# Altium schematic sheet S09_Connectors.SchDoc: Connectors
size 381 x 241 mm; SheetNumber: 9; SheetTotal: 12
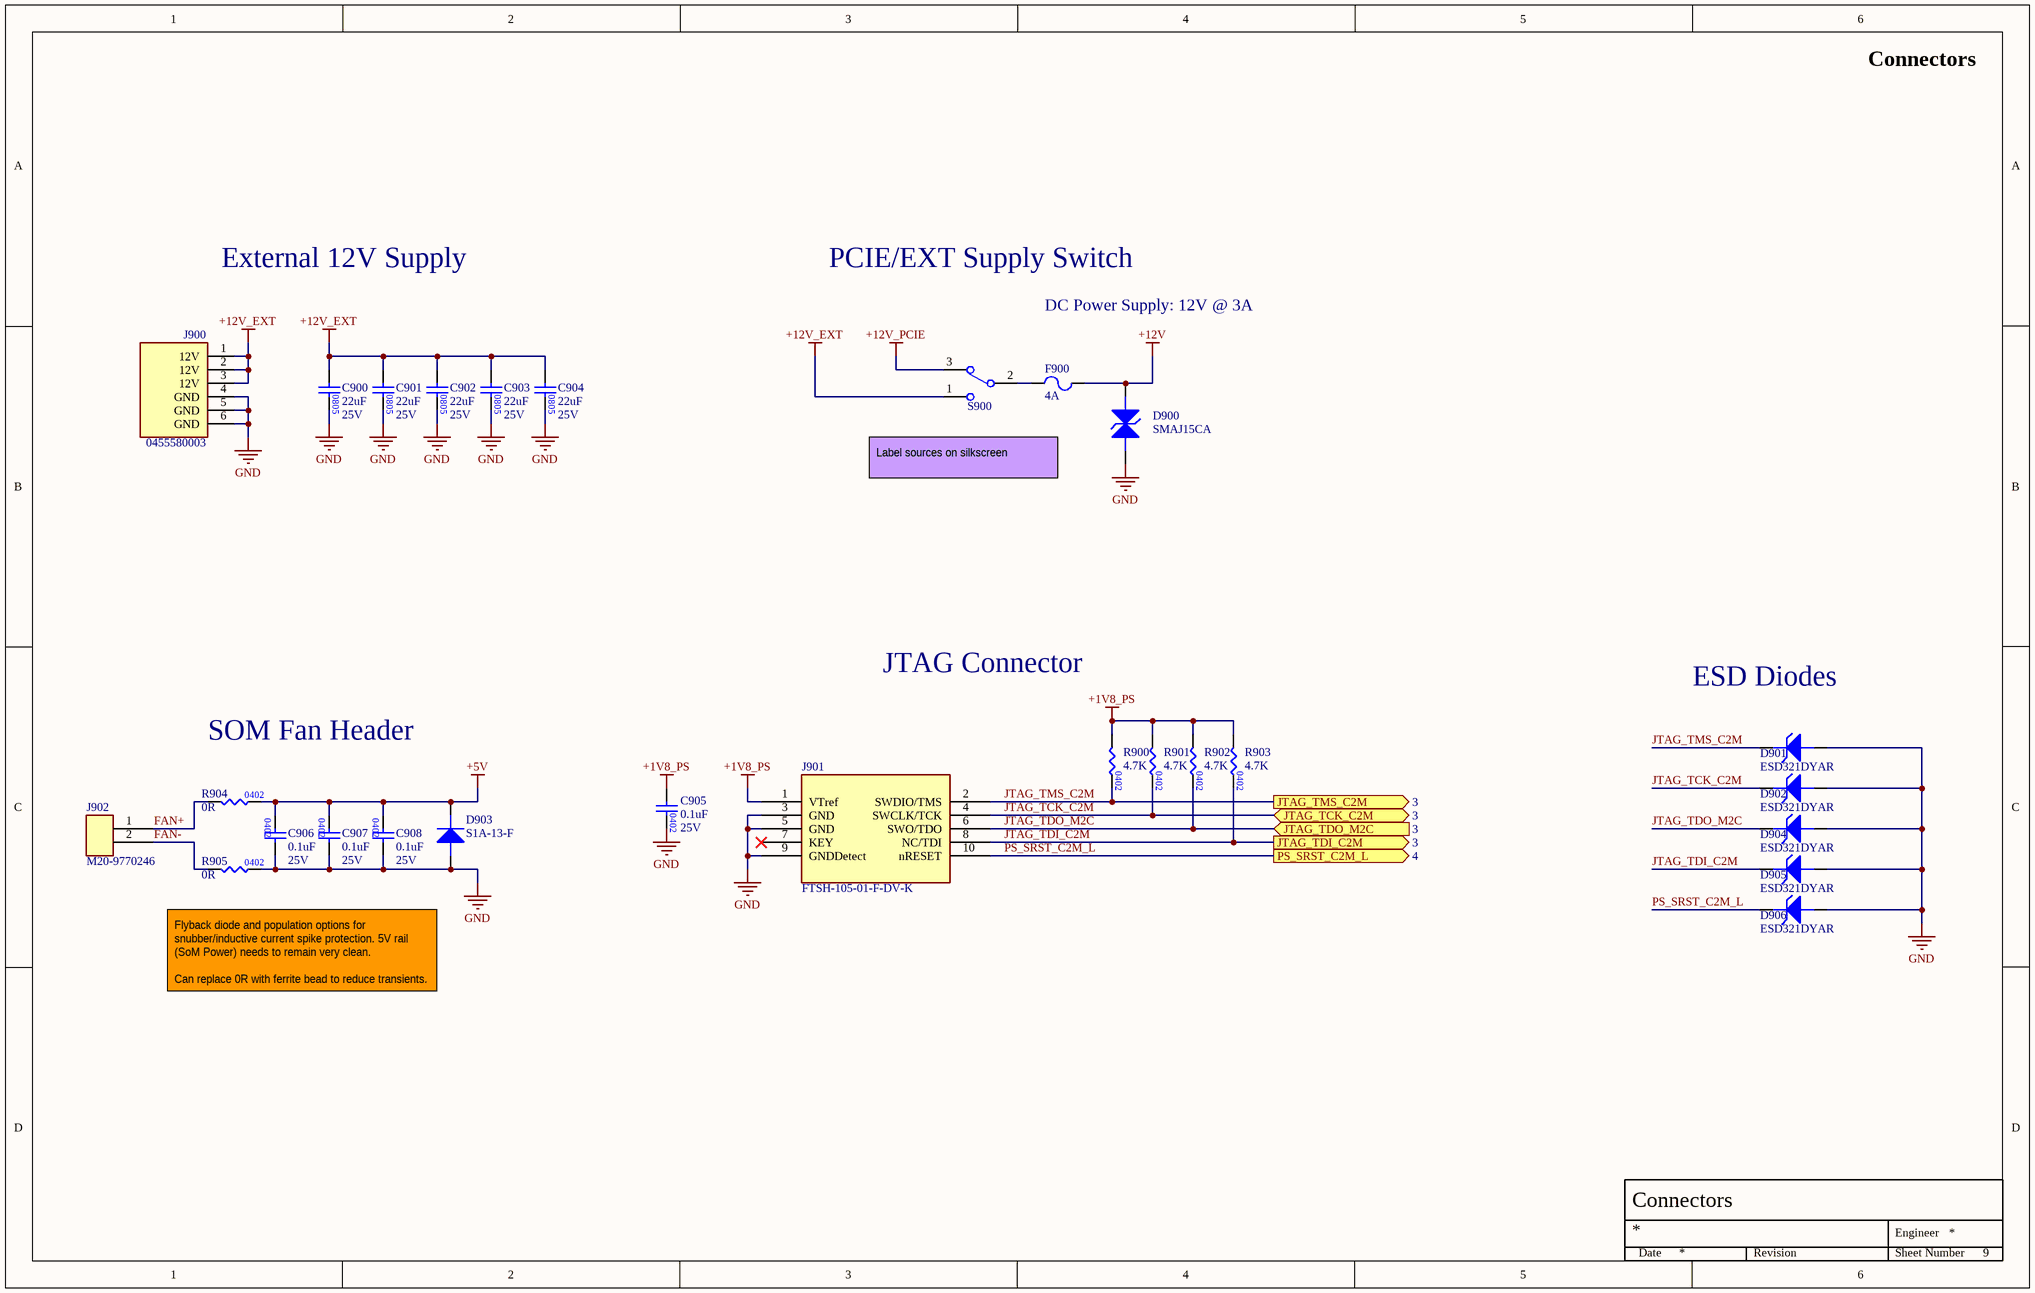
[diagram p0: S09_Connectors.SchDoc]

## Parts
C900  value 22uF  Voltage Rating: 25V  [CAP0805]  (hidden comment: CAP_0805)
C901  value 22uF  Voltage Rating: 25V  [CAP0805]  (hidden comment: CAP_0805)
C902  value 22uF  Voltage Rating: 25V  [CAP0805]  (hidden comment: CAP_0805)
C903  value 22uF  Voltage Rating: 25V  [CAP0805]  (hidden comment: CAP_0805)
C904  value 22uF  Voltage Rating: 25V  [CAP0805]  (hidden comment: CAP_0805)
C905  value 0.1uF  Voltage Rating: 25V  [CAP0402]  (hidden comment: CAP_0402)
C906  value 0.1uF  Voltage Rating: 25V  [CAP0402]  (hidden comment: CAP_0402)
C907  value 0.1uF  Voltage Rating: 25V  [CAP0402]  (hidden comment: CAP_0402)
C908  value 0.1uF  Voltage Rating: 25V  [CAP0402]  (hidden comment: CAP_0402)
D900  TVS DIODE 15VWM 24.4VC DO214AC  [LITTLEFUSE_DO-2014]  (value not drawn)
D901  ESD321DYAR  [TI_SOD523]
D902  ESD321DYAR  [TI_SOD523]
D903  S1A-13-F  [DIODES_SMA]
D904  ESD321DYAR  [TI_SOD523]
D905  ESD321DYAR  [TI_SOD523]
D906  ESD321DYAR  [TI_SOD523]
F900  Current Rating: 4A  [FUSE_0603]  (hidden comment: FUSE_4A_0603)
J900  0455580003  [0455580003]
J901  FTSH-105-01-F-DV-K  [FTSH-105-01-F-DV-K-P-TR]
J902  M20-9770246  [61300211121]
R900  Resistance: 4.7K  [RES0402]  (hidden comment: RES_0402)
R901  Resistance: 4.7K  [RES0402]  (hidden comment: RES_0402)
R902  Resistance: 4.7K  [RES0402]  (hidden comment: RES_0402)
R903  Resistance: 4.7K  [RES0402]  (hidden comment: RES_0402)
R904  Resistance: 0R  [RES0402]  (hidden comment: RES_0402)
R905  Resistance: 0R  [RES0402]  (hidden comment: RES_0402)
S900  SW_SLIDE_TOGGLE  [500SSP1S2M2QEA]  (value not drawn)

## Ports
JTAG_TCK_C2M (bidir, see 3), JTAG_TDI_C2M (out, see 3), JTAG_TDO_M2C (in, see 3), JTAG_TMS_C2M (out, see 3), PS_SRST_C2M_L (out, see 4)

## Nets
+1V8_PS: C905.1 J901.1(VTref) R900.1 R901.1 R902.1 R903.1
+5V: C906.1 C907.1 C908.1 D903.K(Cathode) R904.2
+12V: D900.A(Anode) F900.2
+12V_EXT: C900.1 C901.1 C902.1 C903.1 C904.1 J900.1(12V) J900.2(12V) J900.3(12V) S900.1
+12V_PCIE: S900.3
GND: C900.2 C901.2 C902.2 C903.2 C904.2 C905.2 C906.2 C907.2 C908.2 D900.K(Cathode) D901.A(Anode) D902.A(Anode) D903.A(Anode) D904.A(Anode) D905.A(Anode) D906.A(Anode) J900.4(GND) J900.5(GND) J900.6(GND) J901.3(GND) J901.5(GND) J901.9(GNDDetect) R905.2
FAN+: J902.1 R904.1
FAN-: J902.2 R905.1
JTAG_TCK_C2M: D902.K(Cathode) J901.4(SWCLK/TCK) R901.2 ; port JTAG_TCK_C2M
JTAG_TDI_C2M: D905.K(Cathode) J901.8(NC/TDI) R903.2 ; port JTAG_TDI_C2M
JTAG_TDO_M2C: D904.K(Cathode) J901.6(SWO/TDO) R902.2 ; port JTAG_TDO_M2C
JTAG_TMS_C2M: D901.K(Cathode) J901.2(SWDIO/TMS) R900.2 ; port JTAG_TMS_C2M
PS_SRST_C2M_L: D906.K(Cathode) J901.10(nRESET) ; port PS_SRST_C2M_L
NetF900_1: F900.1 S900.2

Not connected (* = marked no-connect by the designer): J901 7(KEY)*

## Notes on the sheet
- External 12V Supply
- PCIE/EXT Supply Switch
- DC Power Supply: 12V @ 3A
- Label sources on silkscreen
- JTAG Connector
- ESD Diodes
- SOM Fan Header
- Flyback diode and population options for snubber/inductive current spike protection. 5V rail (SoM Power) needs to remain very clean.
  Can replace 0R with ferrite bead to reduce transients.
- Engineer
- Date
- Revision
- Sheet Number

## Library data of the parts
C900-C904 = CAP_CL21A226MAYNNNE: CAP CER 22UF 25V X5R 0805; Manufacturer: Samsung Electro-Mechanics; Tolerance: 20%; Manufacturer Part Number 1: CL21A226MAYNNNE; Case/Package: 0805; Mounting Type: Surface Mount; Temperature Coefficient: X5R
C905-C908 = CAP_CL05A104KA5NNNC: CAP CER 0.1UF 25V X5R 0402; Manufacturer: Samsung Electro-Mechanics; Tolerance: 10%; Manufacturer Part Number 1: CL05A104KA5NNNC; Case/Package: 0402; Mounting Type: Surface Mount; Temperature Coefficient: X5R
D900 = SMAJ15CA: 24.4V Clamp 16.4A Ipp Tvs Diode Surface Mount DO-214AC (SMA); Manufacturer Part Number: SMAJ15CA
D901 D902 D904-D906 = ESD321DYAR: TVS DIODE 3.6VWM 6.3VC SOT5X3; Manfacturer Part Number: ESD321DYAR
D903 = S1A-13-F: Diode 50 V 1A Surface Mount SMA; Reverse Voltage: 50V; Forward Voltage: 1.1V; Manufacturer Part Number: S1A-13-F; Current Rating: 1A
F900 = FUSE_4A_0603: FUSE SMD 4A 32V; Manufacturer 1: Vishay; Manufacturer Part Number 1: MFU0603FF04000P500; Package/Footprint: 0603; Voltage Rating (DC): 32V; Supplier 1: Digi-Key; Mounting Type: SMD; Supplier Part Number 1: 749-MFU0603FF04000P500DKR-ND
J900 = 0455580003: Connector Header Through Hole, Right Angle 6 position 0.165" (4.20mm); Manufacturer_Name: Molex; Datasheet Link: http://www.molex.com/pdm_docs/sd/455580003_sd.pdf; Height: 10mm; Manufacturer_Part_Number: 0455580003; Mouser Part Number: N/A; Mouser Price/Stock: https://www.mouser.co.uk/ProductDetail/Molex/0455580003?qs=PBcRNPEHKsr%252BGoTfgbyscA%3D%3D; Arrow Part Number: 0455580003; Arrow Price/Stock: https://www.arrow.com/en/products/0455580003/molex?region=nac
J901 = FTSH-105-01-F-DV-K: CONN HEADER SMD 10POS 1.27MM; Manufacturer: Samtec; Number of Positions: 10; Number of Rows: 2; Manufacturer Part Number 1: FTSH-105-01-F-DV-K
J902 = M20-9770246: CONN HEADER VERT 2POS 2.54MM; Positions: 2; Rows: 1; Manufacturer Part Number: M20-9770246
R900-R903 = .RES_RC0402FR-074K7L: RES 4.7K OHM 1% 1/16W 0402; Manufacturer: YAGEO; Manufacturer Part Number: RC0402FR-074K7L; Case/Package: 0402; Tolerance: 1%
R904 R905 = .RES_RC0402JR-070RL: RES 0 OHM JUMPER 1/16W 0402; Manufacturer: YAGEO; Tolerance: 1%; Manufacturer Part Number: RC0402JR-070RL; Case/Package: 0402
S900 = SW_SLIDE_TOGGLE: SWITCH SLIDE SPDT 5A 28V; Manufacturer 1: E-Switch; Package/Footprint: TH; Supplier 1: Digi-Key; Mounting Type: TH; Voltage Rating (DC): 28V; Throw Configuration: SPDT; Supplier Part Number 1: EG5137-ND; Manufacturer Part Number 1: 500SSP1S2M2QEA